# EAGLE design rftoy31 (EAGLE 9.6.2)
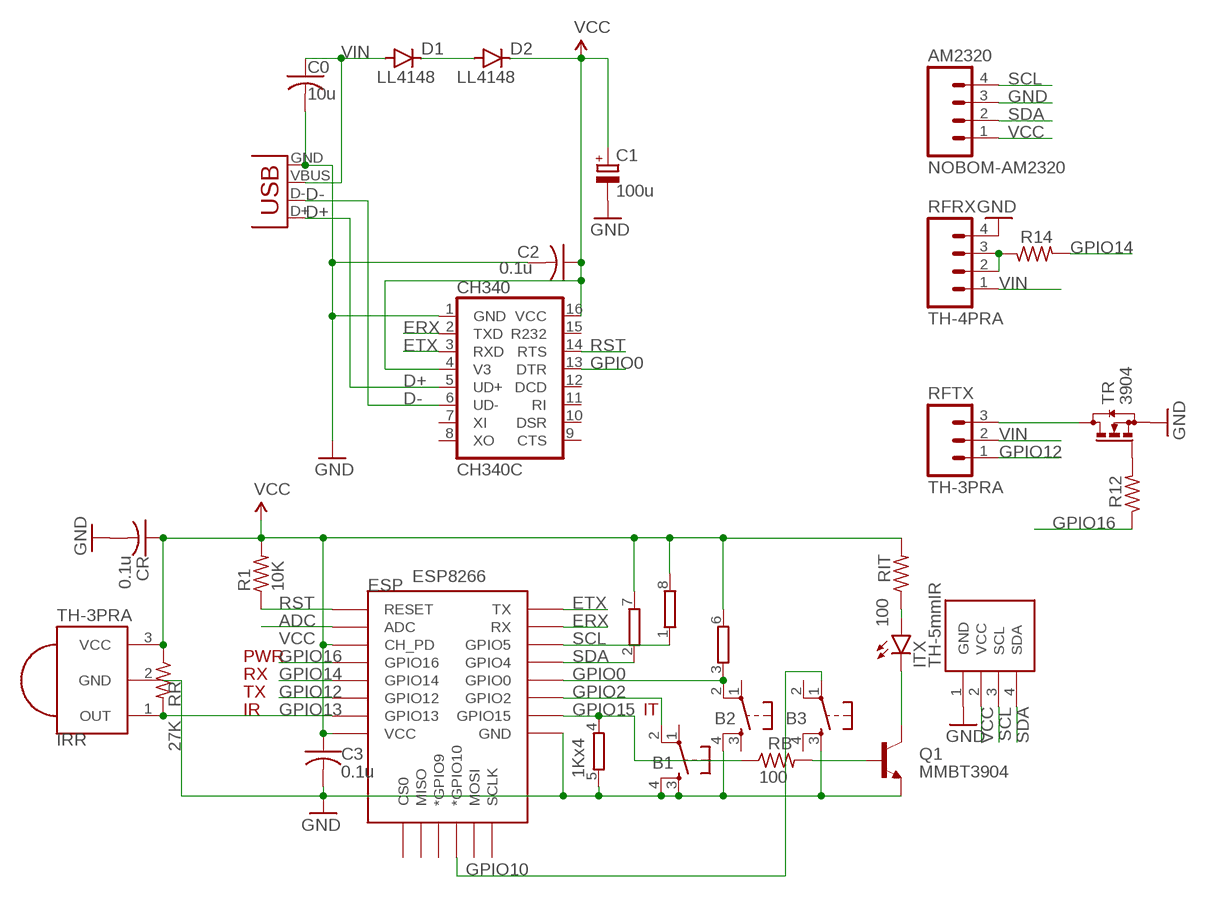
[diagram p0: schematic, sheet 1]

## Parts
AM2320  NOBOM-AM2320  M041X04_NO_SILK  [1X04_NO_SILK]
B1  TH-TACT6x9  SPST_TACT  [EVQ-Q2-SMD]
B2  TH-TACT6x9  SPST_TACT  [EVQ-Q2-SMD]
B3  TH-TACT6x9  SPST_TACT  [EVQ-Q2-SMD]
C0  10u  C-USC0805K  [C0805K]
C1  100u  CPOL-EUC  [PANASONIC_C]
C2  0.1u  C-USC0603K  [C0603K]
C3  0.1u  C-USC0603  [C0603]
CH340  CH340C  CH340G  [SO16]
CR  0.1u  C-USC0603  [C0603]
D1  LL4148  DIODE-MINIMELF  [MINIMELF]
D2  LL4148  DIODE-MINIMELF  [MINIMELF]
ESP  ESP8266  ESP12ESMD  [ESP12E-SMD]
IRR  TH-3PRA  PNA460XM  [PNA460XM]
ITX  TH-5mmIR  LEDIRL80A  [IRL80A]
LCD  NOBOM-OLED  SSD1306_OLED_I2CPCB0.75B  [SSD1306_OLED_I2C_PCB_0.75_B]
Q1  MMBT3904  TRANSISTOR_NPNSOT23  [SOT23]
R1  10K  R-US_R0603  [R0603]
R12  1K  R-US_R0603  [R0603]
R14  1K  R-US_R0603  [R0603]
RB  100  R-US_R0603  [R0603]
RFRX  TH-4PRA  M04LONGPADS  [1X04_LONGPADS]
RFTX  TH-3PRA  M031X03_NO_SILK  [1X03_NO_SILK]
RIT  100  R-US_R0603  [R0603]
RN1  1Kx4  4R-NEXB38V  [EXB38V]
RR  27K  R-US_R0603  [R0603]
TR  3904  BSS123  [SOT23]
X3  USBMICROB2  [USB-MICROB2]

## Nets
ADC: ESP.ADC
D+: CH340.5(UD+) X3.D+
D-: CH340.6(UD-) X3.D-
ERX: CH340.2(TXD) ESP.RXD0(RX)
ETX: CH340.3(RXD) ESP.TXD0(TX)
GND: AM2320.3 B1.3 B1.4 B2.4 B3.3 C0.2 C1.- C2.2 C3.2 CH340.1(GND) CR.2 ESP.GND IRR.2(GND) LCD.1(GND) Q1.2(E) RFRX.4 RN1.5 TR.2(S) X3.GND
GPIO0: B2.2 CH340.13(DTR) ESP.GPIO0 RN1.3
GPIO2: B1.2 ESP.GPIO2
GPIO10: B3.1 ESP.GPIO10(*GPIO10)
GPIO12: ESP.GPIO12 RFTX.1
GPIO13: ESP.GPIO13 IRR.1(OUT) RR.2
GPIO14: ESP.GPIO14 R14.2
GPIO15: ESP.GPIO15 RB.1 RN1.4
GPIO16: ESP.GPIO16 R12.1
N$1: D1.C D2.A
N$2: ITX.K(C) Q1.3(C)
N$4: Q1.1(B) RB.2
N$7: R12.2 TR.1(G)
N$8: ITX.A RIT.1
N$26: R14.1 RFRX.2 RFRX.3
N$28: RFTX.3 TR.3(D)
RST: CH340.14(RTS) ESP.RESET R1.1
SCL: AM2320.4 ESP.GPIO5 LCD.3(SCL) RN1.1
SDA: AM2320.2 ESP.GPIO4 LCD.4(SDA) RN1.2
VCC [vcc]: AM2320.1 C1.+ C2.1 C3.1 CH340.4(V3) CH340.16(VCC) CR.1 D2.C ESP.CH_PD ESP.VCC IRR.3(VCC) LCD.2(VCC) R1.2 RIT.2 RN1.6 RN1.7 RN1.8 RR.1
VIN [vin]: C0.1 D1.A RFRX.1 RFTX.2 X3.VBUS
Unconnected: B1.1 B2.1 B2.3 B3.2 B3.4 CH340.7(XI) CH340.8(XO) CH340.9(CTS) CH340.10(DSR) CH340.11(RI) CH340.12(DCD) CH340.15(R232) ESP.CS0 ESP.GPIO9(*GPIO9) ESP.MISO ESP.MOSI ESP.SCLK

## Notes on the sheet
- PWR
- RX
- TX
- IR | IT

## Library data of the parts
AM2320 RFRX = SparkFun:M04: Header 4 Standard 4-pin 0.1" header. Use with straight break away headers (SKU : PRT-00116), right angle break away headers (PRT-00553), swiss pins (PRT-00743), machine pins (PRT-00117), and female headers (PRT-00115). Molex polarized connector foot print use with SKU : PRT-08231 with associated crimp pins and housings.
B1-B3 = adafruit_3:SPST_TACT: SMT 6mm switch, EVQQ2 series http://www.ladyada.net/library/eagle
C0 = adafruit2013:C-US: CAPACITOR, American symbol
C1 = rcl:CPOL-EU: POLARIZED CAPACITOR, European symbol; SPICEPREFIX: C
C2 C3 CR = adafruit:C-US: CAPACITOR, American symbol
CH340 = SparkFunNew:CH340
D1 D2 = diode:DIODE-: DIODE
ESP = esp8266modules:ESP12E: ESP12E Module
IRR = adafruit_3:PNA460XM: IR 38KHz receiver PNA4602 and related receivers http://www.ladyada.net/library/pcb/eaglelibrary.html
ITX = led:LED: LED OSRAM: - CHIPLED LG R971, LG N971, LY N971, LG Q971, LY Q971, LO R971, LY R971 LH N974, LH R974 LS Q976, LO Q976, LY Q976 LO Q996 - Hyper CHIPLED LW Q18S LB Q993, LB Q99A, LB R99A - SideLED LS A670, LO A670, LY A670, LG A670, LP A670 LB A673, LV A673, LT A673, LW A673 LH A674 LY A675 LS A676, LA A676, LO A676, LY A676, LW A676 LS A679, LY A679, LG A679 - Hyper Micro SIDELED® LS Y876, LA Y876, LO Y876, LY Y876 LT Y87S - SmartLED LW L88C, LW L88S LB L89C, LB L89S, LG L890 LS L89K, LO L89K, LY L89K LS L896, LA L896, LO L896, LY L896 - TOPLED LS T670, LO T670, LY T670, LG T670, LP T670 LSG T670, LSP T670, LSY T670, LOP T670, LYG T670 LG T671, LOG T671, LSG T671 LB T673, LV T673, LT T673, LW T673 LH T674 LS T676, LA T676, LO T676, LY T676, LB T676, LH T676, LSB T676, LW T676 LB T67C, LV T67C, LT T67C, LS T67K, LO T67K, LY T67K, LW E67C LS E67B, LA E67B, LO E67B, LY E67B, LB E67C, LV E67C, LT E67C LW T67C LS T679, LY T679, LG T679 LS T770, LO T770, LY T770, LG T770, LP T770 LB T773, LV T773, LT T773, LW T773 LH T774 LS E675, LA E675, LY E675, LS T675 LS T776, LA T776, LO T776, LY T776, LB T776 LHGB T686 LT T68C, LB T68C - Hyper Mini TOPLED® LB M676 - Mini TOPLED Santana® LG M470 LS M47K, LO M47K, LY M47K Source: http://www.osram.convergy.de LUXEON: - LUMILED® LXK2-PW12-R00, LXK2-PW12-S00, LXK2-PW14-U00, LXK2-PW14-V00 LXK2-PM12-R00, LXK2-PM12-S00, LXK2-PM14-U00 LXK2-PE12-Q00, LXK2-PE12-R00, LXK2-PE12-S00, LXK2-PE14-T00, LXK2-PE14-U00 LXK2-PB12-K00, LXK2-PB12-L00, LXK2-PB12-M00, LXK2-PB14-N00, LXK2-PB14-P00, LXK2-PB14-Q00 LXK2-PR12-L00, LXK2-PR12-M00, LXK2-PR14-Q00, LXK2-PR14-R00 LXK2-PD12-Q00, LXK2-PD12-R00, LXK2-PD12-S00 LXK2-PH12-R00, LXK2-PH12-S00 LXK2-PL12-P00, LXK2-PL12-Q00, LXK2-PL12-R00 Source: www.luxeon.com KINGBRIGHT: KA-3528ASYC Source: www.kingbright.com
LCD = adafruit2013:SSD1306_OLED_I2C
Q1 = SparkFun:TRANSISTOR_NPN: Transistor NPN BJT configuration in SOT23 package. MMBT2222 is the common NPN we use. Double check BCE configuration again layout.
R1 RB RIT RR = adafruit2013:R-US_: RESISTOR, American symbol
R12 R14 = adafruitGood:R-US_: RESISTOR, American symbol
RFTX = SparkFun:M03: Header 3 Standard 3-pin 0.1" header. Use with straight break away headers (SKU : PRT-00116), right angle break away headers (PRT-00553), swiss pins (PRT-00743), machine pins (PRT-00117), and female headers (PRT-00115). Molex polarized connector foot print use with SKU : PRT-08232 with associated crimp pins and housings.
RN1 = resistor-dil:4R-N: Array Chip Resistor Source: RS Component / Phycomp; OC_FARNELL: unknown; OC_NEWARK: unknown
TR = transistor-small-signal:BSS123: N-CHANNEL MOS FET
X3 = SparkFunNew:USB: USB Connectors USB-B-PTH is fully proven SKU : PRT-00139 USB-miniB is fully proven SKU : PRT-00587 USB-A-PCB is untested. USB-A-H is throughly reviewed, but untested. Spark Fun Electronics SKU : PRT-00437 USB-B-SMT is throughly reviewed, but untested. Needs silkscreen touching up. USB-A-S has not been used/tested USB-MB-H has not been used/tested

## Net classes
0 default: width 0.178 mm
2 vcc: width 0.305 mm
3 vin: width 0.406 mm
4 adc: width 0.203 mm
6 I2C: width 0.203 mm

## Board
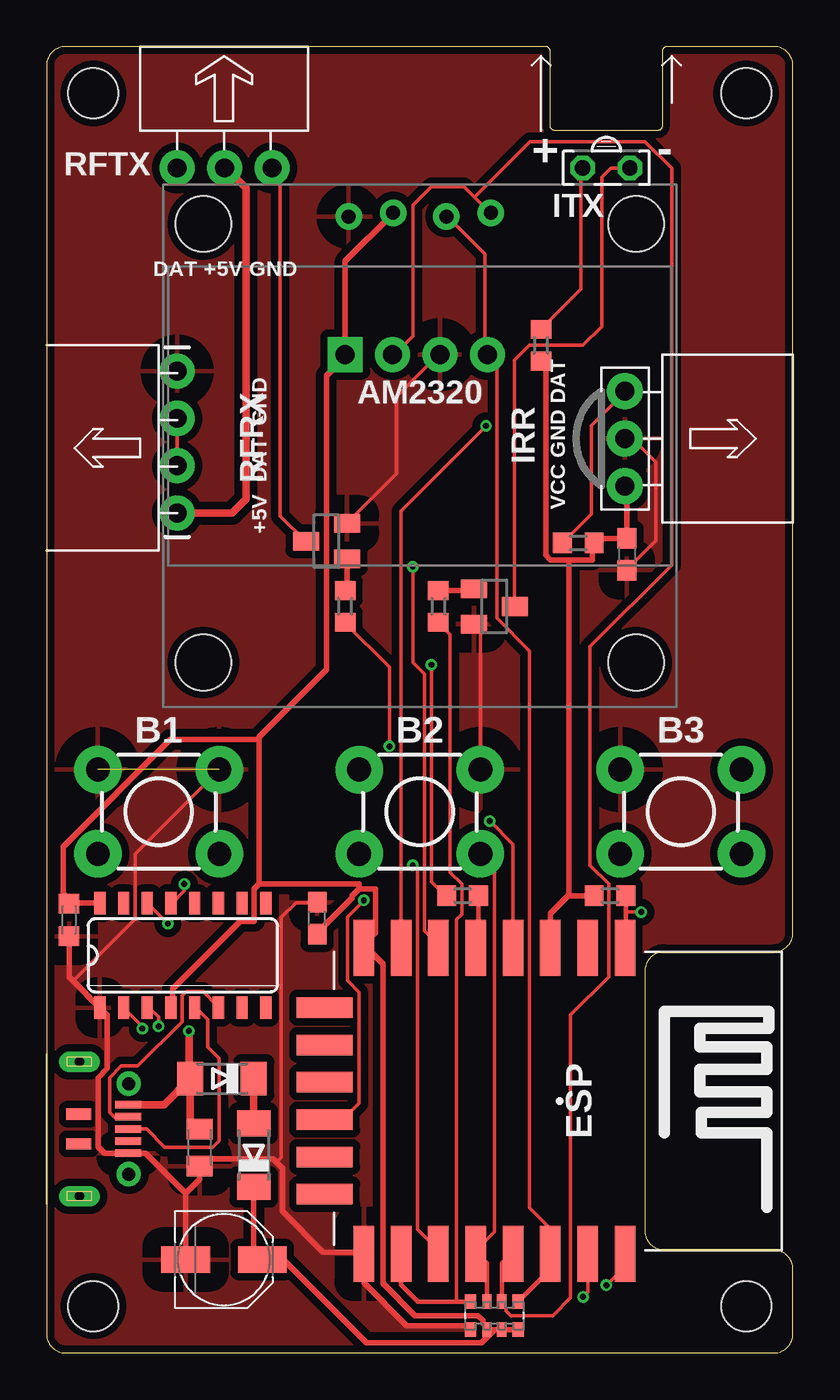
[diagram p1: board, top side]
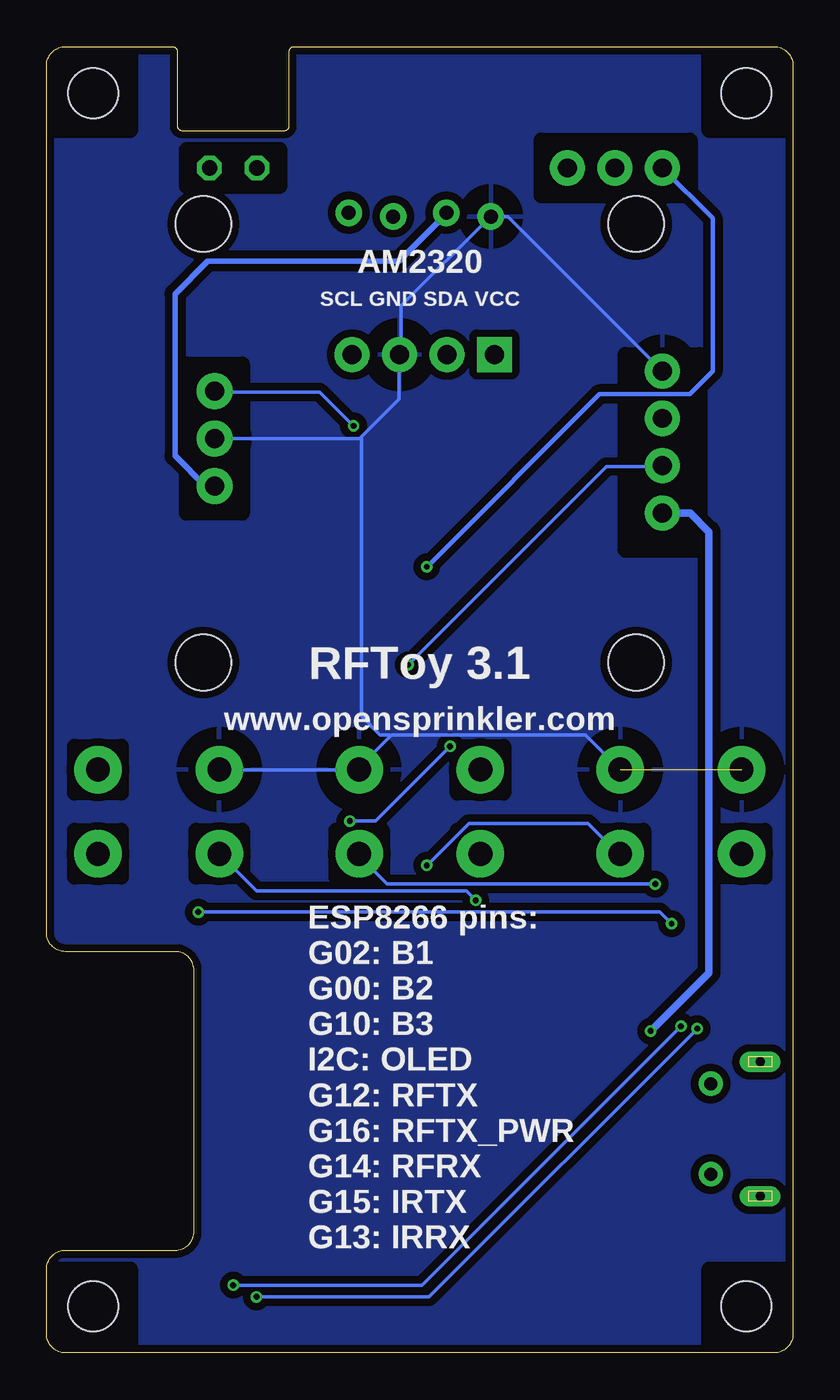
[diagram p2: board, bottom side, seen from below]

Size 40 x 70 mm. Coordinates in mm from the lower left corner, seen from the top.
Outline: 40,1 40,4.5 arc90 39,5.5 33.1,5.5 arc-90 32.1,6.5 32.1,20.5 arc-90 33.1,21.5 39,21.5 arc90 40,22.5 40,69 arc90 39,70 33.25,70 arc90 33,69.75 33,65.75 arc-90 32.75,65.5 27.25,65.5 arc-90 27,65.75 27,69.75 arc90 26.75,70 1,70 arc90 0,69 0,1 arc90 1,0 39,0 arc90 40,1
Copper layers (1*16): Top 0.035mm / dielectric 1.5mm / Bottom 0.035mm
Design rules "Fusion_eagle_rule_v1.1 *": minimum track width 6mil, minimum drill 12mil, track to track 6mil, track to pad 6mil, pad to pad 6mil, via to via 6mil, smd to smd 0mil, copper to edge 10mil, drill to drill 10mil, minimum pad ring 10mil, minimum via ring 6mil, stop-mask expansion 2mil, vias tented up to drill 100mil, thermal gap 40mil
Holes 2.7 mm at 2.5,67.5 37.5,67.5 2.5,2.5 37.5,2.5
bRestrict: area 5,43 to 9,53.5; area 5.5,62 to 13.5,65; area 27.5,62.5 to 32.5,64.5; area 29.5,45 to 32.5,53; area 36,30 to 38.5,32.5; area 36,25.5 to 38.5,28; area 29.5,30 to 32,32.5; area 29.5,25.5 to 32,28; area 1.5,30 to 4,32.5; area 1.5,25.5 to 4,28; area 8,30 to 10.5,32.5; area 8,25.5 to 10.5,28; 8 more areas
vRestrict: area 16.5,6.5 to 32.5,20.5

### Footprints (pad centres in the part's own frame; a part is rotated, then mirrored left to right if it is on the bottom)
1X04_NO_SILK = drill 1.016 pad 1.88 square: 1 0,0 | drill 1.016 pad 1.88: 2 0,2.54; 3 0,5.08; 4 0,7.62
EVQ-Q2-SMD = drill 1.27 pad 2.54: 1 -3.251,-2.261; 2 3.251,-2.261; 3 -3.251,2.261; 4 3.251,2.261
C0805K = smd 1.1 x 1.4: 1 -1,0; 2 1,0
PANASONIC_C = smd 2.6 x 1.4: + 2.05,0; - -2.05,0
C0603K = smd 1.05 x 1.08: 1 -0.875,0; 2 0.875,0
C0603 = smd 1.1 x 1: 1 -0.85,0; 2 0.85,0
SO16 = smd 0.6 x 1.2: 1 -4.445,-2.8; 2 -3.175,-2.8; 3 -1.905,-2.8; 4 -0.635,-2.8; 5 0.635,-2.8; 6 1.905,-2.8; 7 3.175,-2.8; 8 4.445,-2.8; 9 4.445,2.8; 10 3.175,2.8; 11 1.905,2.8; 12 0.635,2.8; 13 -0.635,2.8; 14 -1.905,2.8; 15 -3.175,2.8; 16 -4.445,2.8
MINIMELF = smd 1.4 x 1.8: A 1.7,0; C -1.7,0
ESP12E-SMD = smd 1.1 x 3: ADC -1.5,-8.2; CH_PD 0.5,-8.2; GND 10.5,8.2; GPIO0 4.5,8.2; GPIO2 6.5,8.2; GPIO4 2.5,8.2; GPIO5 0.5,8.2; GPIO12 6.5,-8.2; GPIO13 8.5,-8.2; GPIO14 4.5,-8.2; GPIO15 8.5,8.2; GPIO16 2.5,-8.2; RESET -3.5,-8.2; RXD0 -1.5,8.2; TXD0 -3.5,8.2; VCC 10.5,-8.2 | smd 3 x 1.1: CS0 12.6,-5; GPIO9 12.6,-1; GPIO10 12.6,1; MISO 12.6,-3; MOSI 12.6,3; SCLK 12.6,5
PNA460XM = drill 1.016 pad 1.93: 1 -2.54,0; 2 0,0; 3 2.54,0
IRL80A = drill 0.813 octagon: A 0,-1.27; K 0,1.27
SSD1306_OLED_I2C_PCB_0.75_B = drill 0.75 pad 1.422: 1 -3.81,-0.1; 2 -1.42,0.1; 3 1.42,-0.1; 4 3.81,0.1 | hole 3: 11.6,-24; -11.6,-24; -11.6,-0.5; 11.6,-0.5
SOT23 = smd 1 x 1.4: 1 -0.95,-1.1; 2 0.95,-1.1; 3 0,1.1
R0603 = smd 1 x 1.1: 1 -0.85,0; 2 0.85,0
1X04_LONGPADS = drill 1.016 pad 1.88: 1 0,0; 2 2.54,0; 3 5.08,0; 4 7.62,0
1X03_NO_SILK = drill 1.016 pad 1.88: 1 0,0; 2 2.54,0; 3 5.08,0
EXB38V = smd 0.6 x 0.8: 1 -1.275,-0.75; 4 1.275,-0.75; 5 1.275,0.75; 8 -1.275,0.75 | smd 0.5 x 0.8: 2 -0.4,-0.75; 3 0.4,-0.75; 6 0.4,0.75; 7 -0.4,0.75
USB-MICROB2 = smd 1.4 x 0.4: D+ -1.375,0; D- -1.375,-0.65; GND -1.375,1.3; ID -1.375,0.65; VBUS -1.375,-1.3 | drill 0.5 pad 1.1 long: MT1 1.25,-3.6; MT2 1.25,3.6 | smd 1.35 x 0.6: MT3 1.275,0.8; MT4 1.275,-0.8 | drill 0.7 pad 1.3: MT5 -1.4,-2.425; MT6 -1.4,2.425

### Placement (x,y rotation side)
AM2320  16,53.5 270 top
B1  6,29 0 top
B2  20,29 0 top
B3  34,29 0 top
C0  8.2,11 270 top
C1  9.5,5 0 top
C2  1.2,23.2 270 top
C3  14.5,23.3 90 top
CH340  7.3,21.3 0 top
CR  31.1,42.8 270 top
D1  9.4,14.7 180 top
D2  11.1,10.6 90 top
ESP  27.5,13.5 180 top
IRR  31,49 270 top
ITX  30,63.5 270 top
LCD  20,61 0 top
Q1  24,40 270 top
R1  30.2,24.5 180 top
R12  16,40 90 top
R14  22.3,24.5 0 top
RB  21,40 90 top
RFRX  7,45 90 top
RFTX  7,63.5 0 top
RIT  26.5,54 270 top
RN1  24,2 180 top
RR  28.5,43.4 180 top
TR  15,43.5 90 top
X3  3,12 180 top

### Tracks (layer width: path | path; a pad name or v marks a point on that pad's centre or on a via)
D+
  Top 0.178: X3.D+ 5.35,12 6.33,11.03 8.9,11.03 9.25,11.38 9.25,15.78 8.62,16.4 8.62,17.88 8,18.5 CH340.5
D-
  Top 0.178: CH340.6 9.21,18.55 8.38,19.38 7.5,19.38 7.25,19.12 7.25,17.75 4.88,15.38 4,15.38 3.38,14.75 3.38,12.9 3.67,12.6 4.33,12.6 X3.D-
ERX  (via drill 0.3)
  Top 0.178: CH340.2 5.12,17.5 v5.12,17.38 | v28.75,3 29,3.25 ESP.RXD0
  Bottom 0.178: v5.12,17.38 19.5,3 v28.75,3
ETX  (via drill 0.3)
  Top 0.178: v6,17.5 6,18 5.5,18.5 CH340.3 | v30,3.62 31,4.62 ESP.TXD0
  Bottom 0.178: v6,17.5 19.88,3.62 v30,3.62
GND  (1 unrouted)
  Top 0.178: IRR.2 31.4,49 32.65,47.75 32.65,43.52 31.12,42 CR.2 | TR.2 16.12,44.5 18.75,47.12 18.75,51.25 21,53.5 AM2320.3 | Q1.2 23,39 23.25,38.75 23.25,31.38 B2.4 | C3.2 14.5,24.12 13.38,24.12 12.57,23.32 12.57,10.45 12.33,10.2 | 1.43,19.93 4.75,23.25 4.75,26.75 B1.4
  Top 0.305: RN1.5 22.52,1.45 19.3,1.45 17,3.75 ESP.GND 17,5.39 14.82,5.39 12.64,7.57 12.64,9.89 12.33,10.2 12.13,10.4 8.6,10.4 C0.2 8.2,9.3 7.45,8.55 | C2.2 1.2,20.16 1.43,19.93 CH340.1 3.25,18.11 3.25,15.25 2.75,14.75 2.75,11.05 3.1,10.7 X3.GND 5.3,10.7 7.45,8.55 | C1.- 7.45,8.55
  Bottom 0.178: RFRX.4 15.28,60.9 LCD.1 16.25,60.88 21,56.12 21,53.5 AM2320.3 21.12,53.5 21.12,51.12 23.19,49.06 | IRR.2 23.25,49 23.19,49.06 | B3.3 30.62,31.25 23.38,31.25 B2.4 23.25,31.38 21.56,33.06 | 21.56,33.06 21.5,33.12 11.12,33.12 9.38,31.38 B1.4 | 23.19,49.06 23.12,49 23.12,34.12 22.12,33.12 21.62,33.12 21.56,33.06
  pour Top (isolate 0.406): 0,70 40,70 40,0 0.25,0 0,0.25
  pour Bottom (isolate 0.406): 0,70 40,70 40,0 0.25,0 0,0.25
GPIO0  (via drill 0.3)
  Top 0.178: v7.38,25.12 7.38,24.75 6.75,24.12 CH340.13 | ESP.GPIO0 23,5.5 24,6.5 24,26 23.38,26.62 B2.2
  Top 0.254: RN1.3 23.6,4.8 ESP.GPIO0
  Bottom 0.178: v7.38,25.12 21.75,25.12 23.25,26.62 B2.2
GPIO2  (via drill 0.3)
  Top 0.178: v19.62,26.12 19.88,25.88 19.88,6.62 21,5.5 ESP.GPIO2
  Bottom 0.178: v19.62,26.12 17.38,28.38 11,28.38 9.38,26.75 B1.2
GPIO10  (via drill 0.3)
  Top 0.178: v17,24.25 16.12,23.38 16.12,19.95 16.75,19.32 16.75,13.38 15.75,12.38 15,12.38 ESP.GPIO10
  Bottom 0.178: v17,24.25 17.5,24.75 28.75,24.75 30.62,26.62 B3.1
GPIO12  (via drill 0.3)
  Top 0.178: v19.62,42.12 19.62,37 20.25,36.38 20.25,22.62 21,21.88 ESP.GPIO12
  Bottom 0.254: v19.62,42.12 10.38,51.38 5.53,51.38 4.3,52.6 4.3,60.8 RFTX.1
GPIO13  (via drill 0.3)
  Top 0.178: RR.2 29.2,44.95 29.2,49.7 31,51.5 IRR.1 | ESP.GPIO13 19,45.12 v23.55,49.67
  Bottom 0.178: v23.55,49.67 25.38,51.5 31,51.5 IRR.1
GPIO14
  Top 0.254: R14.2 23.15,21.95 ESP.GPIO14
GPIO15
  Top 0.178: 21.98,2.75 21.98,23.23 22.25,23.5 22.25,25.12 21.62,25.75 21.62,38.5 21,39.12 RB.1
  Top 0.254: RN1.4 21.98,2.75 19.9,2.75 19,3.65 ESP.GPIO15
GPIO16  (via drill 0.3)
  Top 0.178: v18.38,32.5 18.38,36.75 16,39.12 R12.1 | v23.75,28.5 25,27.25 ESP.GPIO16
  Bottom 0.178: v18.38,32.5 22.38,28.5 v23.75,28.5
N$1
  Top 0.406: D1.C D2.A
N$2
  Top 0.178: Q1.3 25.07,40.02 25.07,53.2 25.88,54 28.75,54 29.75,55 29.75,63 30.25,63.5 ITX.K
N$4
  Top 0.305: RB.2 22.8,40.85 Q1.1
N$7
  Top 0.305: TR.1 16.1,40.95 R12.2
N$8
  Top 0.178: RIT.1 26.5,54.88 28.62,57 28.62,63.5 ITX.A
N$26  (via drill 0.3)
  Top 0.178: v20.62,36.88 20.62,25.25 21.38,24.5 R14.1 | RFRX.2 RFRX.3
  Bottom 0.178: v20.62,36.88 10,47.5 7,47.5 RFRX.2
N$28
  Top 0.178: TR.3 13.88,43.5 12.53,44.85 12.53,63.5 RFTX.3
RST  (via drill 0.3)
  Top 0.178: v6.5,23 5.5,24 CH340.14 | 31.05,23.62 v31.88,23.62
  Top 0.254: R1.1 31.05,23.62 31.05,21.85 ESP.RESET
  Bottom 0.178: v6.5,23 7.12,23.62 v31.88,23.62
SCL
  Top 0.178: LCD.3 21.5,60.88 23.5,58.88 23.5,53.5 AM2320.4 24.12,53 24.12,39.38 25.88,37.62 25.88,7.78 27,6.65 ESP.GPIO5
  Top 0.254: ESP.GPIO5 27,4.47 RN1.1
SDA
  Top 0.178: 22.94,61.94 22.38,62.5 20.62,62.5 19.62,61.5 19.62,54.5 18.62,53.5 AM2320.2 | 22.94,61.94 23.75,61.12 LCD.4 | 22.94,61.94 25.9,64.9 32.08,64.9 33.5,63.48 33.5,42.23 29.12,37.85 29.12,26.12 30.12,25.12 30.12,20.15 28.07,18.1 28.07,2.95 27.12,2 24.88,2 24.62,2.25 24.62,2.38 24.38,2.62 RN1.2
  Top 0.254: RN1.2 24.4,4.8 ESP.GPIO4
VCC
  Top 0.305: RN1.8 RN1.7 24.01,1.25 | 24,1.25 RN1.6 23.62,1.38 23.38,1.62 23.38,1.75 23.12,2 19.75,2 18.02,3.73 18.02,20.85 17.12,21.75 ESP.VCC 17,21.88 17.62,22.5 17.62,24.88 16.75,24.88 | 24.01,1.25 24,1.25 | 24.01,1.25 24,1.25 | 24,1.25 23.3,0.55 17.16,0.55 12.7,5 C1.+ 11.1,5.35 D2.C | CH340.16 1.23,24.1 C2.1 1.25,24.25 0.88,24.62 0.88,27.12 6.62,32.88 11.38,32.88 | ESP.CH_PD 27,23.55 27.95,24.5 | 27.95,24.5 R1.2 | IRR.3 31.1,46.36 CR.1 29.6,43.65 RR.1 29.25,43.38 29.25,42.5 28,42.5 | 28,42.5 27,42.5 26.75,42.75 26.75,52.88 26.5,53.12 RIT.2 | 28,42.5 28,24.62 27.95,24.5 | LCD.2 18.5,61 16,58.5 AM2320.1 16,53.38 15,52.38 15,36.62 11.38,33 11.38,32.88 | 24,1.25 | 16.75,24.88 16.38,24.5 16.38,24.38 14.5,22.5 C3.1 | 11.38,25.12 11.12,24.88 11.12,23.12 10.38,23.12 6.75,19.5 6.75,18.5 CH340.4 | 11.38,25.12 16.75,25.12 16.75,24.88 | 11.38,25.12 11.38,32.88
  Bottom 0.305: IRR.3 31.51,46.46 33.12,48.08 33.12,56.75 31.38,58.5 21.12,58.5 18.62,61 LCD.2
VIN  (via drill 0.3)
  Top 0.406: C0.1 7.7,12.5 D1.A | X3.VBUS 6.3,13.3 D1.A | v7.62,17.25 7.62,14.88 D1.A | RFRX.1 9.95,45 10.7,45.75 10.7,62.42 9.62,63.5 RFTX.2
  Bottom 0.406: v7.62,17.25 4.5,20.38 4.5,44 5.5,45 RFRX.1

### Text on the board
tPlace: + | - | DAT +5V GND | VCC GND DAT | +5V DAT GND
bPlace: AM2320 | SCL GND SDA VCC | RFToy 3.1 | www.opensprinkler.com | ESP8266 pins: / G02: B1 / G00: B2 / G10: B3 / I2C: OLED / G12: RFTX / G16: RFTX_PWR / G14: RFRX / G15: IRTX / G13: IRRX